# Altium schematic sheet SCH - Power, Connector.SchDoc
size A4; CompanyName: James Cook University; DrawnBy1: Liam McLaren; Organization: James Cook University; Title1: Assignment 2 - qfuse; Revision: 1.6; SheetNumber: 2; SheetTotal: 4; Title2: Power & Connection; DrawnBy2: Jacob Finger; ProjectName: *ProjectName
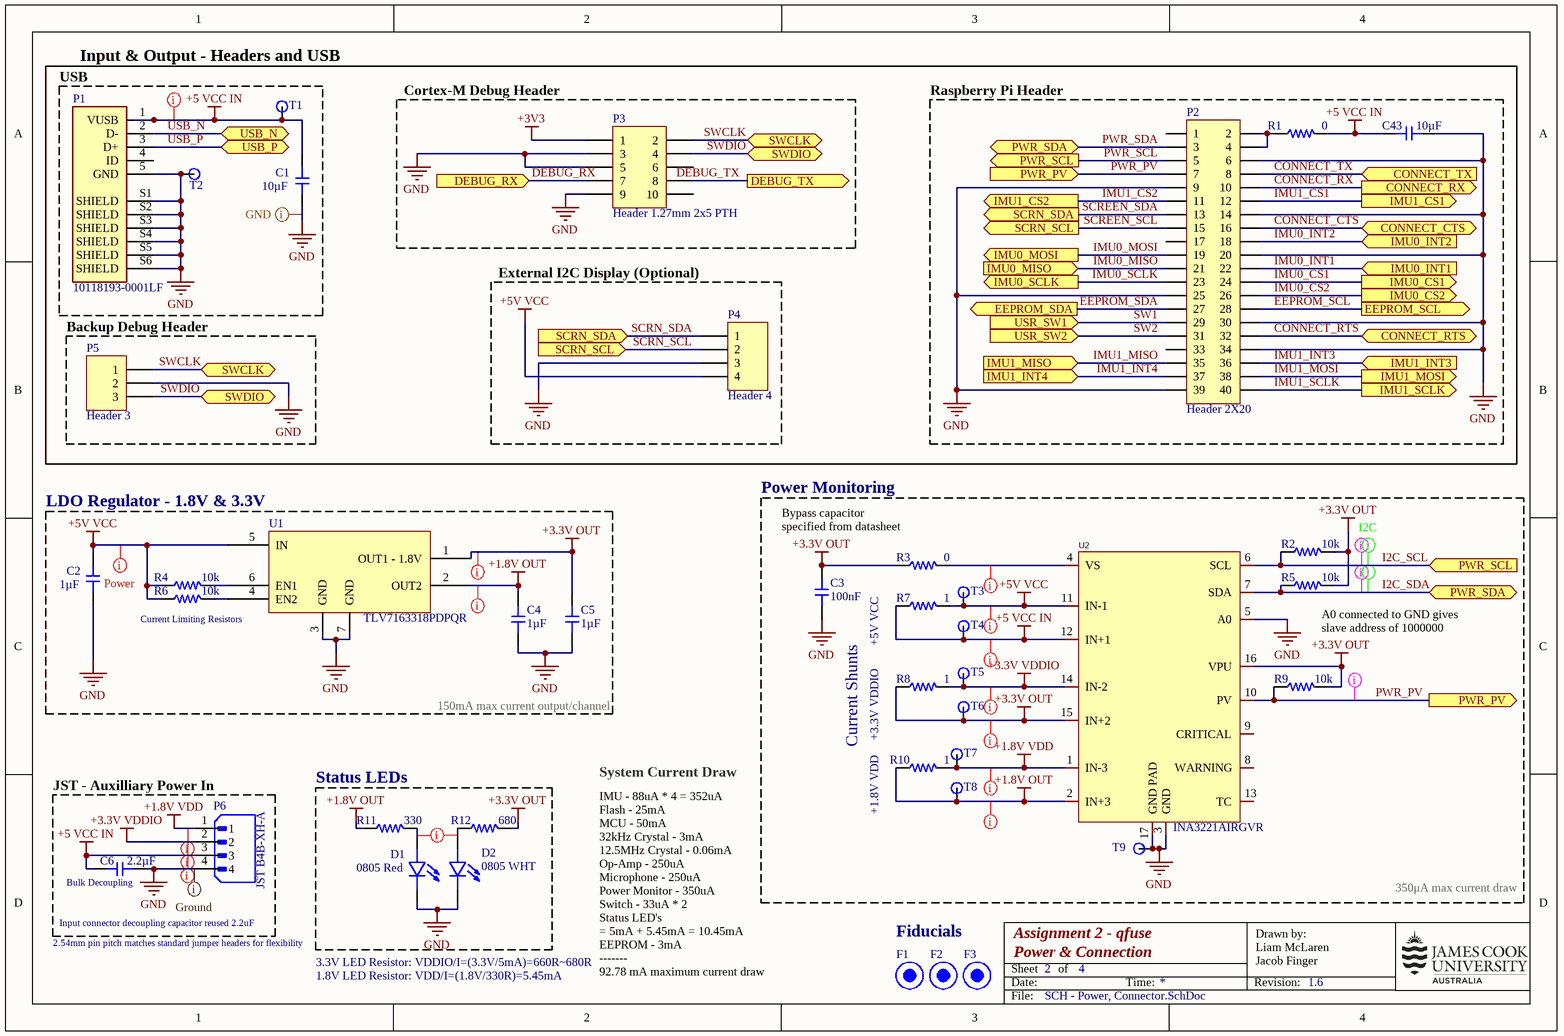
[diagram p0: SCH - Power, Connector.SchDoc]

## Parts
C1  value 10µF  [CAP-0402]  (hidden comment: CL05A106MQ5NUNC)
C2  value 1µF  [CAP-0402]  (hidden comment: CL05A105KA5NQNC)
C3  value 100nF  [CAP-0402]  (hidden comment: CL05B104KB54PNC)
C4  value 1µF  [CAP-0402]  (hidden comment: CL05A105KA5NQNC)
C5  value 1µF  [CAP-0402]  (hidden comment: CL05A105KA5NQNC)
C6  value 2.2µF  [CAP-0402]  (hidden comment: CL05A225MQ5NSNC)
C43  value 10µF  [CAP-0402]  (hidden comment: CL05A106MQ5NUNC)
D1  0805 Red  [NCD0805R1]
D2  0805 WHT  [LED_KT-0805G]
F1  Fiducial Pad  [Fiducial]  (value not drawn)
F2  Fiducial Pad  [Fiducial]  (value not drawn)
F3  Fiducial Pad  [Fiducial]  (value not drawn)
P1  10118193-0001LF  [FCI_10118193-0001LF]
P2  Header 2X20  [HDR2X20]  (no BOM)
P3  Header 1.27mm 2x5 PTH  [Header 1.27mm 2x5 PTH]  (no BOM)
P4  Header 4  [HDR1X4]  (no BOM)
P5  Header 3  [HDR1X3]  (no BOM)
P6  JST B4B-XH-A  [JST_B4B-XH-A]  (no BOM)
R1  value 0  [RES-0402]  (hidden comment: 0402WGF0000TCE)
R2  value 10k  [RES-0402]  (hidden comment: 0402WGF1002TCE)
R3  value 0  [RES-0402]  (hidden comment: 0402WGF0000TCE)
R4  value 10k  [RES-0402]  (hidden comment: 0402WGF1002TCE)
R5  value 10k  [RES-0402]  (hidden comment: 0402WGF1002TCE)
R6  value 10k  [RES-0402]  (hidden comment: 0402WGF1002TCE)
R7  value 1  [RES-0402]  (hidden comment: 0402WGF100KTCE)
R8  value 1  [RES-0402]  (hidden comment: 0402WGF100KTCE)
R9  value 10k  [RES-0402]  (hidden comment: 0402WGF1002TCE)
R10  value 1  [RES-0402]  (hidden comment: 0402WGF100KTCE)
R11  value 330  [RES-0402]  (hidden comment: 0402WGF3300TCE)
R12  value 680  [RES-0402]  (hidden comment: 0402WGF6800TCE)
T1  TP  [TestPoint]  (value not drawn)  (no BOM)
T2  TP  [TestPoint]  (value not drawn)  (no BOM)
T3  TP  [TestPoint]  (value not drawn)  (no BOM)
T4  TP  [TestPoint]  (value not drawn)  (no BOM)
T5  TP  [TestPoint]  (value not drawn)  (no BOM)
T6  TP  [TestPoint]  (value not drawn)  (no BOM)
T7  TP  [TestPoint]  (value not drawn)  (no BOM)
T8  TP  [TestPoint]  (value not drawn)  (no BOM)
T9  TP  [TestPoint]  (value not drawn)  (no BOM)
U1  TLV7163318PDPQR  [XDFN-6_L1.2-W1.2-P0.40-BL-EP]
U2  INA3221AIRGVR  [QFN-16_L4.0-W4.0-P0.65-TL-EP2.2]

## Blocks framed on the sheet
USB: C1 P1 T1 T2
Cortex-M Debug Header: P3
Raspberry Pi Header: C43 P2 R1
External I2C Display (Optional): P4
Backup Debug Header: P5
LDO Regulator - 1.8V & 3.3V: C2 C4 C5 R4 R6 U1
JST - Auxilliary Power In: C6 P6
Status LEDs: D1 D2 R11 R12

## Ports
CONNECT_CTS (bidir, see SCH - Compute, Flash[3C]), CONNECT_RTS (bidir, see SCH - Compute, Flash[3C]), CONNECT_RX (out, see SCH - Compute, Flash[3C], SCH - Wireless Coms[3B]), CONNECT_TX (in, see SCH - Compute, Flash[3C], SCH - Wireless Coms[3B]), DEBUG_RX (in, see SCH - Compute, Flash[1C]), DEBUG_TX (out, see SCH - Compute, Flash[1C]), EEPROM_SCL (out, see SCH - Compute, Flash[3D]), EEPROM_SDA (out, see SCH - Compute, Flash[3D]), IMU0_CS1 (out, see SCH - Compute, Flash[3A], SCH - Peripheral[2A]), IMU0_CS2 (out, see SCH - Compute, Flash[3A], SCH - Peripheral[2B]), IMU0_INT1 (in, see SCH - Compute, Flash[3A], SCH - Peripheral[1A]), IMU0_INT2 (in, see SCH - Compute, Flash[3A], SCH - Peripheral[1B]), IMU0_MISO (in, see SCH - Compute, Flash[3A], SCH - Peripheral[2A]), IMU0_MOSI (out, see SCH - Compute, Flash[3A], SCH - Peripheral[2A]), IMU0_SCLK (out, see SCH - Compute, Flash[3A], SCH - Peripheral[2A]), IMU1_CS1 (out, see SCH - Compute, Flash[3A], SCH - Peripheral[4A]), IMU1_CS2 (out, see SCH - Compute, Flash[3B], SCH - Peripheral[4B]), IMU1_INT3 (in, see SCH - Compute, Flash[3B], SCH - Peripheral[3A]), IMU1_INT4 (in, see SCH - Compute, Flash[3B], SCH - Peripheral[3B]), IMU1_MISO (in, see SCH - Compute, Flash[3B], SCH - Peripheral[4A]), IMU1_MOSI (out, see SCH - Compute, Flash[3B], SCH - Peripheral[4A]), IMU1_SCLK (out, see SCH - Compute, Flash[3A], SCH - Peripheral[4A]), PWR_PV (in, see SCH - Compute, Flash[3B], SCH - Power, Connector[4C]), PWR_PV (out, see SCH - Compute, Flash[3B], SCH - Power, Connector[3A]), PWR_SCL (in, see SCH - Compute, Flash[3B], SCH - Power, Connector[3A]), PWR_SCL (out, see SCH - Compute, Flash[3B], SCH - Power, Connector[4C]), PWR_SDA (bidir, see SCH - Compute, Flash[3B], SCH - Power, Connector[3A]), PWR_SDA (bidir, see SCH - Compute, Flash[3B], SCH - Power, Connector[4C]), SCRN_SCL (in, see SCH - Compute, Flash[3B], SCH - Power, Connector[3A]), SCRN_SCL (out, see SCH - Compute, Flash[3B], SCH - Power, Connector[2B]), SCRN_SDA (in, see SCH - Compute, Flash[3B], SCH - Power, Connector[3A]), SCRN_SDA (out, see SCH - Compute, Flash[3B], SCH - Power, Connector[2B]), SWCLK (bidir, see SCH - Compute, Flash[1C], SCH - Power, Connector[1B]), SWCLK (bidir, see SCH - Compute, Flash[1C], SCH - Power, Connector[2A]), SWDIO (bidir, see SCH - Compute, Flash[1C], SCH - Power, Connector[1B]), SWDIO (bidir, see SCH - Compute, Flash[1C], SCH - Power, Connector[2A]), USB_N (bidir, see SCH - Compute, Flash[1B]), USB_P (bidir, see SCH - Compute, Flash[1B]), USR_SW1 (in, see SCH - Compute, Flash[3B], SCH - Peripheral[3C]), USR_SW2 (in, see SCH - Compute, Flash[3B], SCH - Peripheral[3D])

## Nets
+1.8V OUT: C4.2 R10.1 R11.1 T8.1(TP) U1.2(OUT2) U2.2(IN+3)
+1.8V VDD: P6.1 R10.2 T7.1(TP) U2.1(IN-3)
+3.3V OUT: C3.2 C5.2 R2.2 R3.1 R5.2 R8.1 R9.2 R12.2 T6.1(TP) U1.1(OUT1_-_1.8V) U2.15(IN+2) U2.16(VPU)
+3.3V VDDIO: P6.2 R8.2 T5.1(TP) U2.14(IN-2)
+3V3: P3.1
+5 VCC IN: C1.2 C6.2 C43.2 P1.1(VUSB) P6.3 R1.2 R7.1 T1.1(TP) T4.1(TP) U2.12(IN+1)
+5V VCC: C2.2 P4.4 R4.1 R6.1 R7.2 T3.1(TP) U1.5(IN) U2.11(IN-1)
GND: C1.1 C2.1 C3.1 C4.1 C5.1 C6.1 C43.1 D1.C D2.C P1.5(GND) P1.S1(SHIELD) P1.S2(SHIELD) P1.S3(SHIELD) P1.S4(SHIELD) P1.S5(SHIELD) P1.S6(SHIELD) P2.6 P2.9 P2.14 P2.20 P2.25 P2.30 P2.34 P2.39 P3.3 P3.5 P3.9 P4.3 P5.2 P6.4 T2.1(TP) T9.1(TP) U1.3(GND) U1.7(GND) U2.3(GND) U2.5(A0) U2.17(GND_PAD)
CONNECT_CTS: P2.16 ; port CONNECT_CTS
CONNECT_RTS: P2.32 ; port CONNECT_RTS
CONNECT_RX: P2.10 ; port CONNECT_RX
CONNECT_TX: P2.8 ; port CONNECT_TX
DEBUG_RX: P3.7 ; port DEBUG_RX
DEBUG_TX: P3.8 ; port DEBUG_TX
EEPROM_SCL: P2.28 ; port EEPROM_SCL
EEPROM_SDA: P2.27 ; port EEPROM_SDA
I2C_SCL: P2.5 R2.1 U2.6(SCL) ; port PWR_SCL  [also labelled PWR_SCL]
I2C_SDA: P2.3 R5.1 U2.7(SDA) ; port PWR_SDA  [also labelled PWR_SDA]
IMU0_CS1: P2.24 ; port IMU0_CS1
IMU0_CS2: P2.26 ; port IMU0_CS2
IMU0_INT1: P2.22 ; port IMU0_INT1
IMU0_INT2: P2.18 ; port IMU0_INT2
IMU0_MISO: P2.21 ; port IMU0_MISO
IMU0_MOSI: P2.19 ; port IMU0_MOSI
IMU0_SCLK: P2.23 ; port IMU0_SCLK
IMU1_CS1: P2.12 ; port IMU1_CS1
IMU1_CS2: P2.11 ; port IMU1_CS2
IMU1_INT3: P2.36 ; port IMU1_INT3
IMU1_INT4: P2.37 ; port IMU1_INT4
IMU1_MISO: P2.35 ; port IMU1_MISO
IMU1_MOSI: P2.38 ; port IMU1_MOSI
IMU1_SCLK: P2.40 ; port IMU1_SCLK
PWR_PV: P2.7 R9.1 U2.10(PV) ; port PWR_PV
SCREEN_SCL: P2.15 P4.2 ; port SCRN_SCL  [also labelled SCRN_SCL]
SCREEN_SDA: P2.13 P4.1 ; port SCRN_SDA  [also labelled SCRN_SDA]
SW1: P2.29 ; port USR_SW1
SW2: P2.31 ; port USR_SW2
SWCLK: P3.2 P5.1 ; port SWCLK
SWDIO: P3.4 P5.3 ; port SWDIO
USB_N: P1.2(D-) ; port USB_N
USB_P: P1.3(D+) ; port USB_P
NetD1_A: D1.A R11.2
NetD2_A: D2.A R12.1
NetP2_2: P2.2 P2.4 R1.1
NetR3_2: R3.2 U2.4(VS)
NetR4_2: R4.2 U1.6(EN1)
NetR6_2: R6.2 U1.4(EN2)

Not connected (* = marked no-connect by the designer): P1 4(ID); P2 1 17 33; P3 6 10; U2 8(WARNING) 9(CRITICAL) 13(TC)

## Layout directives
net class Power: +1.8V OUT, +1.8V VDD, +3.3V OUT, +3.3V VDDIO, +5 VCC IN, +5V VCC, NetD1_A, NetD2_A, NetR3_2
net class Signals: I2C_SCL, I2C_SDA, PWR_PV
net class I2C: I2C_SCL, I2C_SDA
net class GND: GND
net class Ground: GND

## Notes on the sheet
- Input & Output - Headers and USB
- Power Monitoring
- Bypass capacitor specified from datasheet
- (near U1) Current Limiting Resistors
- (near R7) +5V VCC
- (near R5) A0 connected to GND gives slave address of 1000000
- 150mA max current output/channel
- System Current Draw
- Current Shunts
- +3.3V VDDIO
- (near R10) +1.8V VDD
- Input connector decoupling capacitor reused 2.2uF
- (near C6) Bulk Decoupling
- 350μA max current draw
- 2.54mm pin pitch matches standard jumper headers for flexibility
- 3.3V LED Resistor: VDDIO/I=(3.3V/5mA)=660R~680R
- 1.8V LED Resistor: VDD/I=(1.8V/330R)=5.45mA
- IMU - 88uA * 4 = 352uA
  Flash - 25mA
  MCU - 50mA
  32kHz Crystal - 3mA
  12.5MHz Crystal - 0.06mA
  Op-Amp - 250uA
  Microphone - 250uA
  Power Monitor - 350uA
  Switch - 33uA * 2
  Status LED's
  = 5mA + 5.45mA = 10.45mA
  EEPROM - 3mA
  -------
  92.78 mA maximum current draw
- Fiducials
- Date:
- Sheet
- of
- Time:
- Revision:
- Drawn by:
- File:

## Library data of the parts
C1 C43 = CMP-001-00141-3: Capacitor, Ceramic (MLCC), 10uF, ±20%, 6.3V, X5R, ±20%, SMD 0402; Manufacturer: Samsung Electro-Mechanics; JLCPCB Part Number: C15525; Tolerance: 20%; Temperature Coefficient: X5R; ComponentLink2Description: JLCPCB Part URL; ComponentLink3Description: LCSC Part URL; Voltage Rating: 6.3V; ComponentLink1Description: Datasheet; ComponentLink1URL: https://datasheet.lcsc.com/lcsc/2208231630_Samsung-Electro-Mechanics-CL05A106MQ5NUNC_C15525.pdf; RoHS: Yes; Case/Package: 0402; ComponentLink2URL: https://jlcpcb.com/partdetail/C15525; Manufacturer Part Number: CL05A106MQ5NUNC; Design Item ID: CL05A106MQ5NUNC; Source: jlcpcb_capacitors_basic.schlib; Category: Capacitors - MLCC; ComponentLink3URL: https://lcsc.com/product-detail/Multilayer-Ceramic-Capacitors-MLCC---SMD-SMT_Samsung-Electro-Mechanics-Samsung-Electro-Mechanics-CL05A106MQ5NUNC_C15525.html; JLCPCB Basic Part: Yes
C2 C4 C5 = CMP-001-00140-3: Capacitor, Ceramic (MLCC), 1uF, ±10%, 25V, X5R, ±10%, SMD 0402; Manufacturer: Samsung Electro-Mechanics; Case/Package: 0402; ComponentLink2Description: JLCPCB Part URL; Manufacturer Part Number: CL05A105KA5NQNC; RoHS: Yes; Temperature Coefficient: X5R; Tolerance: 10%; ComponentLink2URL: https://jlcpcb.com/partdetail/C52923; ComponentLink1URL: https://datasheet.lcsc.com/lcsc/1811091611_Samsung-Electro-Mechanics-CL05A105KA5NQNC_C52923.pdf; ComponentLink3URL: https://lcsc.com/product-detail/Multilayer-Ceramic-Capacitors-MLCC---SMD-SMT_Samsung-Electro-Mechanics-Samsung-Electro-Mechanics-CL05A105KA5NQNC_C52923.html; ComponentLink1Description: Datasheet; ComponentLink3Description: LCSC Part URL; JLCPCB Basic Part: Yes; Design Item ID: CL05A105KA5NQNC; JLCPCB Part Number: C52923; Source: jlcpcb_capacitors_basic.schlib; Category: Capacitors - MLCC; Voltage Rating: 25V
C3 = CMP-001-00146-3: Capacitor, Ceramic (MLCC), 100nF, ±10%, 50V, X7R, ±10%, SMD 0402; Manufacturer: Samsung Electro-Mechanics; Source: jlcpcb_capacitors_basic.schlib; ComponentLink2URL: https://jlcpcb.com/partdetail/C307331; JLCPCB Part Number: C307331; JLCPCB Basic Part: Yes; Voltage Rating: 50V; Manufacturer Part Number: CL05B104KB54PNC; RoHS: Yes; Case/Package: 0402; Temperature Coefficient: X7R; ComponentLink1URL: https://datasheet.lcsc.com/lcsc/1810191222_Samsung-Electro-Mechanics-CL05B104KB54PNC_C307331.pdf; Category: Capacitors - MLCC; ComponentLink2Description: JLCPCB Part URL; ComponentLink3Description: LCSC Part URL; Design Item ID: CL05B104KB54PNC; ComponentLink3URL: https://lcsc.com/product-detail/Multilayer-Ceramic-Capacitors-MLCC---SMD-SMT_Samsung-Electro-Mechanics-Samsung-Electro-Mechanics-CL05B104KB54PNC_C307331.html; ComponentLink1Description: Datasheet; Tolerance: 10%
C6 = CMP-001-00142-3: Capacitor, Ceramic (MLCC), 2.2uF, ±20%, 6.3V, X5R, ±20%, SMD 0402; Manufacturer: Samsung Electro-Mechanics; Category: Capacitors - MLCC; Case/Package: 0402; ComponentLink1URL: https://datasheet.lcsc.com/lcsc/1811021410_Samsung-Electro-Mechanics-CL05A225MQ5NSNC_C12530.pdf; Temperature Coefficient: X5R; Tolerance: 20%; Design Item ID: CL05A225MQ5NSNC; JLCPCB Part Number: C12530; Voltage Rating: 6.3V; ComponentLink1Description: Datasheet; ComponentLink2URL: https://jlcpcb.com/partdetail/C12530; Source: jlcpcb_capacitors_basic.schlib; Manufacturer Part Number: CL05A225MQ5NSNC; RoHS: Yes; ComponentLink2Description: JLCPCB Part URL; ComponentLink3Description: LCSC Part URL; JLCPCB Basic Part: Yes; ComponentLink3URL: https://lcsc.com/product-detail/Multilayer-Ceramic-Capacitors-MLCC---SMD-SMT_Samsung-Electro-Mechanics-Samsung-Electro-Mechanics-CL05A225MQ5NSNC_C12530.html
D1 = NCD0805R1: 0805 Red LED | 25mA | Vf = 1.6-2.6V - 20mA 67mcd~195mcd -30℃~+85℃ 615nm~630nm Red 130° 65mW 1.6V~2.6V 0805 Light Emitting Diodes (LED) ROHS; MF: Foshan NationStar Optoelectronics; Package: 0805; MP: NCD0805R1; Check_prices: https://www.snapeda.com/parts/KT-0805W/Hubei+KENTO+Elec/view-part/?ref=eda; LCSC Part #: C84256; JLCPCB Part #: C84256; JLCPCB Part Number: C84256
D2 = KT-0805W: 0805 WHT LED | 25mA | Vf = 2.6-3.2V - 0805 Light Emitting Diodes (LED) ROHS; MF: Hubei KENTO Elec; SnapEDA_Link: https://www.snapeda.com/parts/KT-0805W/Hubei+KENTO+Elec/view-part/?ref=snap; Package: 0805; MP: KT-0805W; LCSC Part #: C34499; JLCPCB Part #: C34499; JLCPCB Part Number: C34499
F1-F3 = Fiducial: 1x2mm Fiducial Pad; ClassName: Fiducial; Component Class name: Fiducial
P1 = CMP-045-000000-8: USB - micro B USB 2.0 Receptacle Connector 5 Position Surface Mount, Right Angle; Through Hole; MF: Amphenol ICC; MP: 10118193-0001LF; Component Type: Standard; Design Item ID: 10118193-0001LF; Pin Count: 11; Package: None; Source: SnapEDAsch.SchLib; SnapEDA_Link: https://www.snapeda.com/parts/10118193-0001LF/Amphenol%20FCI/view-part/2758989/?ref=snap; JLCPCB Part Number: C132562
P2 = HDR2X20: Header, 20-Pin, Dual row, 2.54mm Pin Pitch; Signal Integrity: Connector; LatestRevisionNote: Re-released for DXP Platform.; Publisher: Altium Limited; Pin Count: 40; Source: Miscellaneous Connectors.SchLib; Design Item ID: Header 20X2; Component Type: Standard; LatestRevisionDate: 17-Jul-2002
P3 = CMP-005-0002-2: Header 1.27mm pitch, 2x5, PTH through hole; Pins: 10; element14 Item: 1577743; Design Item ID: Header 1.27mm 2x5 PTH; Source: JCULibrary.SchLib; Component Type: Standard
P4 = CMP-002-00124-1: Header, 4-Pin; Signal Integrity: Connector; LatestRevisionNote: Re-released for DXP Platform.; Component Type: Standard; Design Item ID: Header 4; Source: Miscellaneous Connectors.SchLib; Pin Count: 4; Publisher: Altium Limited; LatestRevisionDate: 17-Jul-2002
P5 = CMP-002-00117-1: Header, 3-Pin; Signal Integrity: Connector; Design Item ID: Header 3; LatestRevisionDate: 17-Jul-2002; Publisher: Altium Limited; Component Type: Standard; Pin Count: 3; Source: Miscellaneous Connectors.SchLib; LatestRevisionNote: Re-released for DXP Platform.
P6 = B4B-XH-A: JST 4 Pin Single Row Header | Top Facing | AWG 22-30 | 3A 250VAC | 10-20mOhm contact impedance | Connector Header Through Hole 4 position 0.098 (2.50mm); MF: JST Sales; MP: B4B-XH-A(LF)(SN); SnapEDA_Link: https://www.snapeda.com/parts/B4B-XH-A(LF)(SN)/JST+Sales+America+Inc./view-part/?ref=snap; Package: None; Value: *; Check_prices: https://www.snapeda.com/parts/B4B-XH-A(LF)(SN)/JST+Sales+America+Inc./view-part/?ref=eda
R1 R3 = CMP-009-00178-4: Resistor, 0Ω, ±1%, 62.5mW, 50V, ±800ppm/℃, -55℃~+155℃, SMD 0402; Manufacturer: Uniroyal; ComponentLink1URL: https://datasheet.lcsc.com/lcsc/2206010216_UNI-ROYAL-Uniroyal-Elec-0402WGF0000TCE_C17168.pdf; JLCPCB Part Number: C17168; Design Item ID: 0402WGF0000TCE; Temperature Coefficient: ±800ppm/℃; Voltage Rating: 50V; Temperature Rating: -55℃~+155℃; Category: Resistors; Case/Package: 0402; JLCPCB Basic Part: Yes; Manufacturer Part Number: 0402WGF0000TCE; ComponentLink2Description: JLCPCB Part URL; Source: jlcpcb_resistors_basic.schlib; Tolerance: 1%; ComponentLink1Description: Datasheet; Power Rating: 62.5mW; ComponentLink2URL: https://jlcpcb.com/partdetail/C17168
R2 R4-R6 R9 = CMP-009-00181-4: Resistor, 10kΩ, ±1%, 62.5mW, 50V, ±100ppm/℃, -55℃~+155℃, SMD 0402; Manufacturer: Uniroyal; Category: Resistors; JLCPCB Part Number: C25744; ComponentLink1Description: Datasheet; ComponentLink2URL: https://jlcpcb.com/partdetail/C25744; Tolerance: 1%; ComponentLink2Description: JLCPCB Part URL; Power Rating: 62.5mW; Manufacturer Part Number: 0402WGF1002TCE; Voltage Rating: 50V; Temperature Rating: -55℃~+155℃; JLCPCB Basic Part: Yes; ComponentLink1URL: https://datasheet.lcsc.com/lcsc/2206010100_UNI-ROYAL-Uniroyal-Elec-0402WGF1002TCE_C25744.pdf; Source: jlcpcb_resistors_basic.schlib; Design Item ID: 0402WGF1002TCE; Case/Package: 0402; Temperature Coefficient: ±100ppm/℃
R7 R8 R10 = CMP-009-00186-4: Resistor, 1Ω, ±1%, 62.5mW, 50V, ±200ppm/℃, -55℃~+155℃, SMD 0402; Manufacturer: Uniroyal; ComponentLink1URL: https://datasheet.lcsc.com/lcsc/2205311900_UNI-ROYAL-Uniroyal-Elec-0402WGF100KTCE_C25086.pdf; Source: jlcpcb_resistors_basic.schlib; Temperature Rating: -55℃~+155℃; Power Rating: 62.5mW; JLCPCB Basic Part: Yes; ComponentLink2Description: JLCPCB Part URL; Manufacturer Part Number: 0402WGF100KTCE; Category: Resistors; Tolerance: 1%; ComponentLink2URL: https://jlcpcb.com/partdetail/C25086; ComponentLink1Description: Datasheet; Voltage Rating: 50V; Case/Package: 0402; Design Item ID: 0402WGF100KTCE; Temperature Coefficient: ±200ppm/℃; JLCPCB Part Number: C25086
R11 = CMP-009-00210-4: Resistor, 330Ω, ±1%, 62.5mW, 50V, ±100ppm/℃, -55℃~+155℃, SMD 0402; Manufacturer: Uniroyal; Source: jlcpcb_resistors_basic.schlib; Temperature Rating: -55℃~+155℃; Voltage Rating: 50V; Temperature Coefficient: ±100ppm/℃; Power Rating: 62.5mW; Category: Resistors; ComponentLink2URL: https://jlcpcb.com/partdetail/C25104; Tolerance: 1%; ComponentLink1URL: https://datasheet.lcsc.com/lcsc/2205311900_UNI-ROYAL-Uniroyal-Elec-0402WGF3300TCE_C25104.pdf; Design Item ID: 0402WGF3300TCE; JLCPCB Part Number: C25104; Case/Package: 0402; JLCPCB Basic Part: Yes; ComponentLink1Description: Datasheet; Manufacturer Part Number: 0402WGF3300TCE; ComponentLink2Description: JLCPCB Part URL
R12 = CMP-009-00231-4: Resistor, 680Ω, ±1%, 62.5mW, 50V, ±100ppm/℃, -55℃~+155℃, SMD 0402; Manufacturer: Uniroyal; Temperature Rating: -55℃~+155℃; ComponentLink2URL: https://jlcpcb.com/partdetail/C25130; Source: jlcpcb_resistors_basic.schlib; Voltage Rating: 50V; ComponentLink1URL: https://datasheet.lcsc.com/lcsc/2205311900_UNI-ROYAL-Uniroyal-Elec-0402WGF6800TCE_C25130.pdf; ComponentLink2Description: JLCPCB Part URL; ComponentLink1Description: Datasheet; Case/Package: 0402; Design Item ID: 0402WGF6800TCE; Manufacturer Part Number: 0402WGF6800TCE; Temperature Coefficient: ±100ppm/℃; Power Rating: 62.5mW; JLCPCB Basic Part: Yes; Tolerance: 1%; JLCPCB Part Number: C25130; Category: Resistors
T1-T9 = TestPoint
U1 = TLV7163318PDPQR: Texas Instruments - TLV7163318PDPQR / 150mA Fixed Positive electrode 5.5V X2SON-6(1.2x1.2) Voltage Regulators - Linear, Low Drop Out (LDO) Regulators ROHS; JLCPCB Part Number: C2859836
U2 = INA3221AIRGVR: Texas Instruments INA3221AIRGVR - QFN-16-EP(4x4) Current Sense Amplifiers ROHS; Manufacturer: TI(德州仪器); Add into BOM: yes; Symbol: INA3221AIRGVR; Device: INA3221AIRGVR; LCSC Part Name: INA3221AIRGVR; Manufacturer Part: INA3221AIRGVR; Supplier Footprint: QFN-16-EP(4x4); JLCPCB Part Class: Extended Part; Datasheet: https://www.ti.com/cn/lit/gpn/ina3221; Supplier: LCSC; Convert to PCB: yes; JLCPCB Part Number: C181255